# Altium project STM_Cerberus.PrjPcb
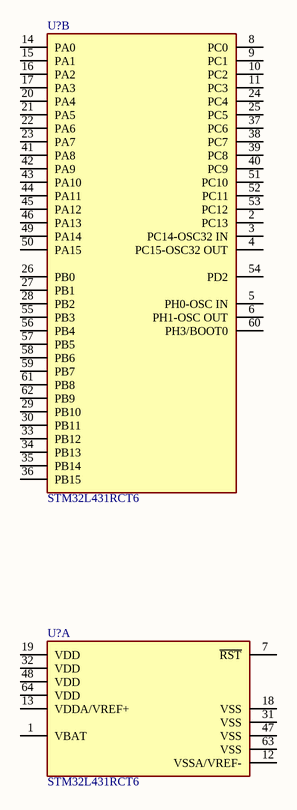
[diagram p0: MCU_Cerberus.SchDoc]
4 sheets, 2 parts. Net scope: global (net labels, ports and power ports of the same name join across sheets).
Board file: STM_Cerberus_PCB.PcbDoc
Sheets:
  MCU_Main.SchDoc
  MCU_Power.SchDoc
  MCU_Cerberus.SchDoc
  MCU_Sensors.SchDoc

## Sheet MCU_Main.SchDoc
size B; SheetNumber: 1; SheetTotal: 4

## Sheet MCU_Power.SchDoc
size B; SheetNumber: 2; SheetTotal: 4

## Sheet MCU_Cerberus.SchDoc
size B; SheetNumber: 3; SheetTotal: 4

### Parts
(Parts that share a designator on the sheet are numbered #1, #2 ... from top to bottom, then left to right.)
U?#1  STM32L431RCT6  [FP-LQFP64-5W-MFG]  (part B of 2)
U?#2  STM32L431RCT6  [FP-LQFP64-5W-MFG]  (part A of 2)

### Nets

Not connected (* = marked no-connect by the designer): U?#1 2(PC13) 3(PC14-OSC32_IN) 4(PC15-OSC32_OUT) 5(PH0-OSC_IN) 6(PH1-OSC_OUT) 8(PC0) 9(PC1) 10(PC2) 11(PC3) 14(PA0) 15(PA1) 16(PA2) 17(PA3) 20(PA4) 21(PA5) 22(PA6) 23(PA7) 24(PC4) 25(PC5) 26(PB0) 27(PB1) 28(PB2) 29(PB10) 30(PB11) 33(PB12) 34(PB13) 35(PB14) 36(PB15) 37(PC6) 38(PC7) 39(PC8) 40(PC9) 41(PA8) 42(PA9) 43(PA10) 44(PA11) 45(PA12) 46(PA13) 49(PA14) 50(PA15) 51(PC10) 52(PC11) 53(PC12) 54(PD2) 55(PB3) 56(PB4) 57(PB5) 58(PB6) 59(PB7) 60(PH3/BOOT0) 61(PB8) 62(PB9); U?#2 1(VBAT) 7(~{RST}) 12(VSSA/VREF-) 13(VDDA/VREF+) 18(VSS) 19(VDD) 31(VSS) 32(VDD) 47(VSS) 48(VDD) 63(VSS) 64(VDD)

### Library data of the parts
U?#1 U?#2 = CMP-12105-000010-1: IC MCU 32BIT 256KB FLASH 64LQFP; Manufacturer: STMicroelectronics; Number Of I/Os: 52; Core Architecture: ARM Cortex-M4; Number Of Pwm Channels: 11; Frequency: 80MHz; Number Of A/D Converters: 1; Number Of Timers/Counters: 8; Standoff Height: 0.05mm; Min Supply Voltage: 1.62V; Memory Size: 256KBytes; Max Supply Voltage: 3.6V; Max Junction Temp: +105°C; Interface: I2C,SPI,USART,CAN,LIN,IrDA,Other; Number Of Spi Channels: 3; Number Of Uart Channels: 4; Data Bus Width: 32bits; Number Of Adc Channels: 16; Ram Size: 64KBytes; Manufacturer Part Number: STM32L431RCT6; Digikey Description: IC MCU 32BIT 256KB FLASH 64LQFP; Device Class L3: Microcontrollers; Device Class L1: Integrated Circuits (ICs); Octopart: https://octopart.com/stm32l431rct6-stmicroelectronics-74606534; Number Of Cores: 1; Automotive: No; Device Class L2: Embedded Processors and Controllers; ComponentLink2URL: https://www.st.com/resource/en/datasheet/stm32l431rc.pdf; Height: 1.6mm; Ambient Temperature Range High: +85°C; Temperature Range High: +105°C; Ambient Temperature Range Low: -40°C; Category: IC; Memory Type: FLASH; Package: LQFP64-5W; Temperature Range Low: -40°C; Lead Free: Yes; Mouser Description: MCU 32-Bit STM32 ARM Cortex M4 RISC 256KB Flash 1.8V/2.5V/3.3V 64-Pin LQFP Tray; Temperature: -40°C to +105°C; ComponentLink2Description: Datasheet; Number Of I2C Channels: 3; RoHS: TRUE

## Sheet MCU_Sensors.SchDoc
size B; SheetNumber: 4; SheetTotal: 4